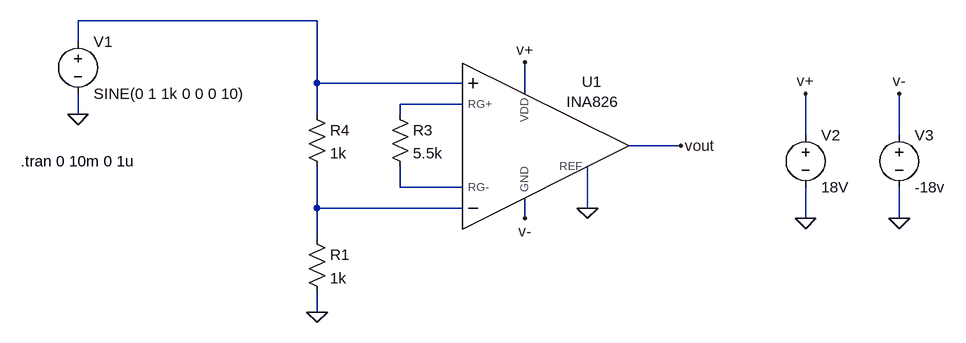
[diagram p0: schematic INA826_test.asc]
INA826_test.asc, the LTspice schematic file:
Version 4
SHEET 1 1180 852
WIRE 208 384 -160 384
WIRE -160 416 -160 384
WIRE 208 480 208 384
WIRE 432 480 208 480
WIRE 528 496 528 448
WIRE 432 512 336 512
WIRE -160 528 -160 496
WIRE 208 528 208 480
WIRE 336 528 336 512
WIRE 960 560 960 496
WIRE 1104 560 1104 496
WIRE 768 576 688 576
WIRE 336 640 336 608
WIRE 432 640 336 640
WIRE 208 672 208 608
WIRE 432 672 208 672
WIRE 624 672 624 608
WIRE 528 688 528 656
WIRE 960 688 960 640
WIRE 1104 688 1104 640
WIRE 208 720 208 672
WIRE 208 832 208 800
FLAG -160 528 0
FLAG 960 688 0
FLAG 1104 688 0
FLAG 960 496 v+
FLAG 1104 496 v-
FLAG 528 448 v+
FLAG 528 688 v-
FLAG 768 576 vout
FLAG 624 672 0
FLAG 208 832 0
SYMBOL voltage -160 400 R0
WINDOW 123 0 0 Left 2
WINDOW 39 0 0 Left 2
SYMATTR InstName V1
SYMATTR Value SINE(0 1 1k 0 0 0 10)
SYMBOL voltage 960 544 R0
WINDOW 123 0 0 Left 2
WINDOW 39 0 0 Left 2
SYMATTR InstName V2
SYMATTR Value 18V
SYMBOL voltage 1104 544 R0
WINDOW 123 0 0 Left 2
WINDOW 39 0 0 Left 2
SYMATTR InstName V3
SYMATTR Value -18v
SYMBOL INA826 528 576 R0
SYMATTR InstName U1
SYMBOL res 320 512 R0
SYMATTR InstName R3
SYMATTR Value 5.5k
SYMBOL res 192 512 R0
SYMATTR InstName R4
SYMATTR Value 1k
SYMBOL res 192 704 R0
SYMATTR InstName R1
SYMATTR Value 1k
TEXT -248 600 Left 2 !.tran 0 10m 0 1u

The netlist it stands for:
* INA826_test.asc
V1 N001 0 SINE(0 1 1k 0 0 0 10)
V2 v+ 0 18V
V3 v- 0 -18v
XU1 N001 N004 v+ v- vout 0 N003 N002 INA826  ; pins IN+ IN- VDD GND OUT REF RG- RG+
R3 N002 N003 5.5k
R4 N001 N004 1k
R1 N004 0 1k
.tran 0 10m 0 1u
.lib INA826.lib
.backanno
.end